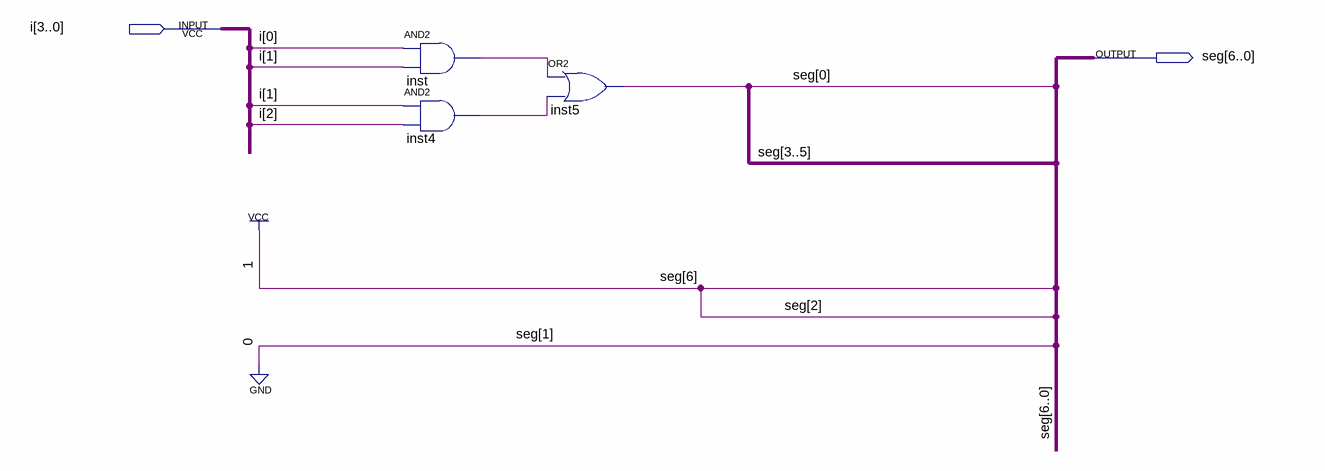
[diagram p0: schematic sheet]
// Quartus schematic MSBbin4tohex7.bdf as structural Verilog: 3 symbols, 2 pins
module MSBbin4tohex7 (
  input  [3:0] i,
  output [6:0] seg
);

  wire inst4_out, inst_out;

  and inst (inst_out, i[0], i[1]);
  and inst4 (inst4_out, i[1], i[2]);
  or inst5 (seg[0], inst_out, inst4_out);

  assign {seg[6], seg[2:1]} = 3'b110;
endmodule
